# Altium schematic sheet Interface.SchDoc
size A4
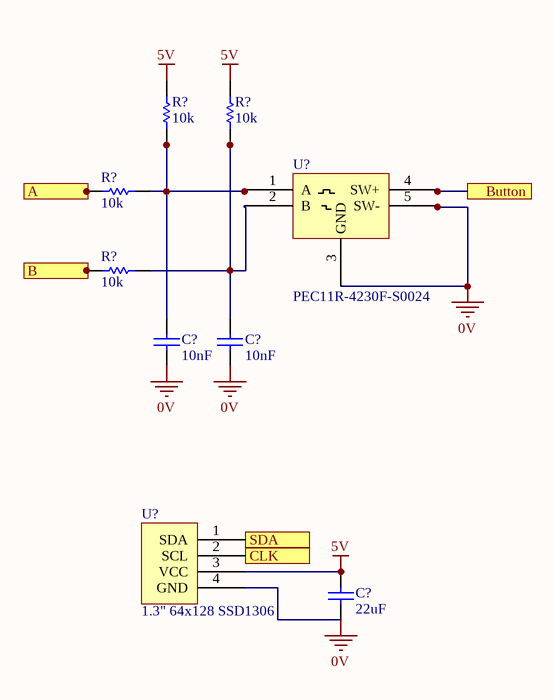
[diagram p0: Interface.SchDoc]

## Parts
(Parts that share a designator on the sheet are numbered #1, #2 ... from top to bottom, then left to right.)
C?#1  10nF  [0805]
C?#2  10nF  [0805]
C?#3  22uF  [1206]
R?#1  10k  [0805]
R?#2  10k  [0805]
R?#3  10k  [0805]
R?#4  10k  [0805]
U?#1  PEC11R-4230F-S0024  [PEC11R-4230F-S0024-ND]
U?#2  1.3" 64x128 SSD1306  [1.3" 64x128 SSD1306]

## Ports
A, B, Button, CLK, SDA

## Nets
0V: C?#3.1 U?#1.3(GND) U?#1.5(SW-) U?#2.4(GND)
5V: C?#3.2 R?#1.2 R?#2.2 U?#2.3(VCC)
Button: U?#1.4(SW+) ; port Button
CLK: U?#2.2(SCL) ; port CLK
SDA: U?#2.1(SDA) ; port SDA
NetC?#1_2: C?#1.2 R?#1.1 R?#3.2 U?#1.1(A)
NetC?#2_2: C?#2.2 R?#2.1 R?#4.2 U?#1.2(B)

Not connected (* = marked no-connect by the designer): C?#1 1; C?#2 1; R?#3 1; R?#4 1

## Notes on the sheet
- Labels drawn without touching a wire or pin: 0V

## Library data of the parts
C?#1 C?#2 = GCM2195C1H103JA16D: Manufacturer: muRata; Tolerance: ±5%; Material: C0G, NP0; Rated Voltage: 50V; Part Number: GCM2195C1H103JA16D; Value: 10nF; Digikey Part Number: 490-4783-1-ND
C?#3 = CC1206MKX5R7BB226: Manufacturer: YAGEO; Tolerance: 20%; Material: Ceramic; Rated Voltage: 16V; Part Number: CC1206MKX5R7BB226; Value: 22uF; Digikey Part Number: 311-1997-2-ND
R?#1-R?#4 = RC0805FR0710KL: Manufacturer: YAGEO; Tolerance: 0.01; Rated Voltage: 0.125W; Part Number: RC0805FR0710KL; Value: 10k; Material: FR-07; Digikey Part Number: 311-10.0KCRCT-ND
U?#1 = PEC11R-4230F-S0024: Quadrature Rotary encoder w/ pushbutton; Manufacturer: Bourns Inc.; Part Number: PEC11R-4230F-S0024; Digikey Part Number: PEC11R-4230F-S0024-ND; Digikey Link: https://www.digikey.com/product-detail/en/bourns-inc/PEC11R-4230F-S0024/PEC11R-4230F-S0024-ND/4699230
U?#2 = 1.3" 64x128 SSD1306: 1.3" I2C OLED display using SSD1306 Driver; Manufacturer: IIC; Part Number: 1.3" 64x128 SSD1306